# EasyEDA schematic 1-Schematic_SumoBot.json
TITLE: SumobotLeonel; REV: 1.0; Date: 2023-10-10; Sheet: 1/1; Drawn By: stevenleonel22201; Company: NONE
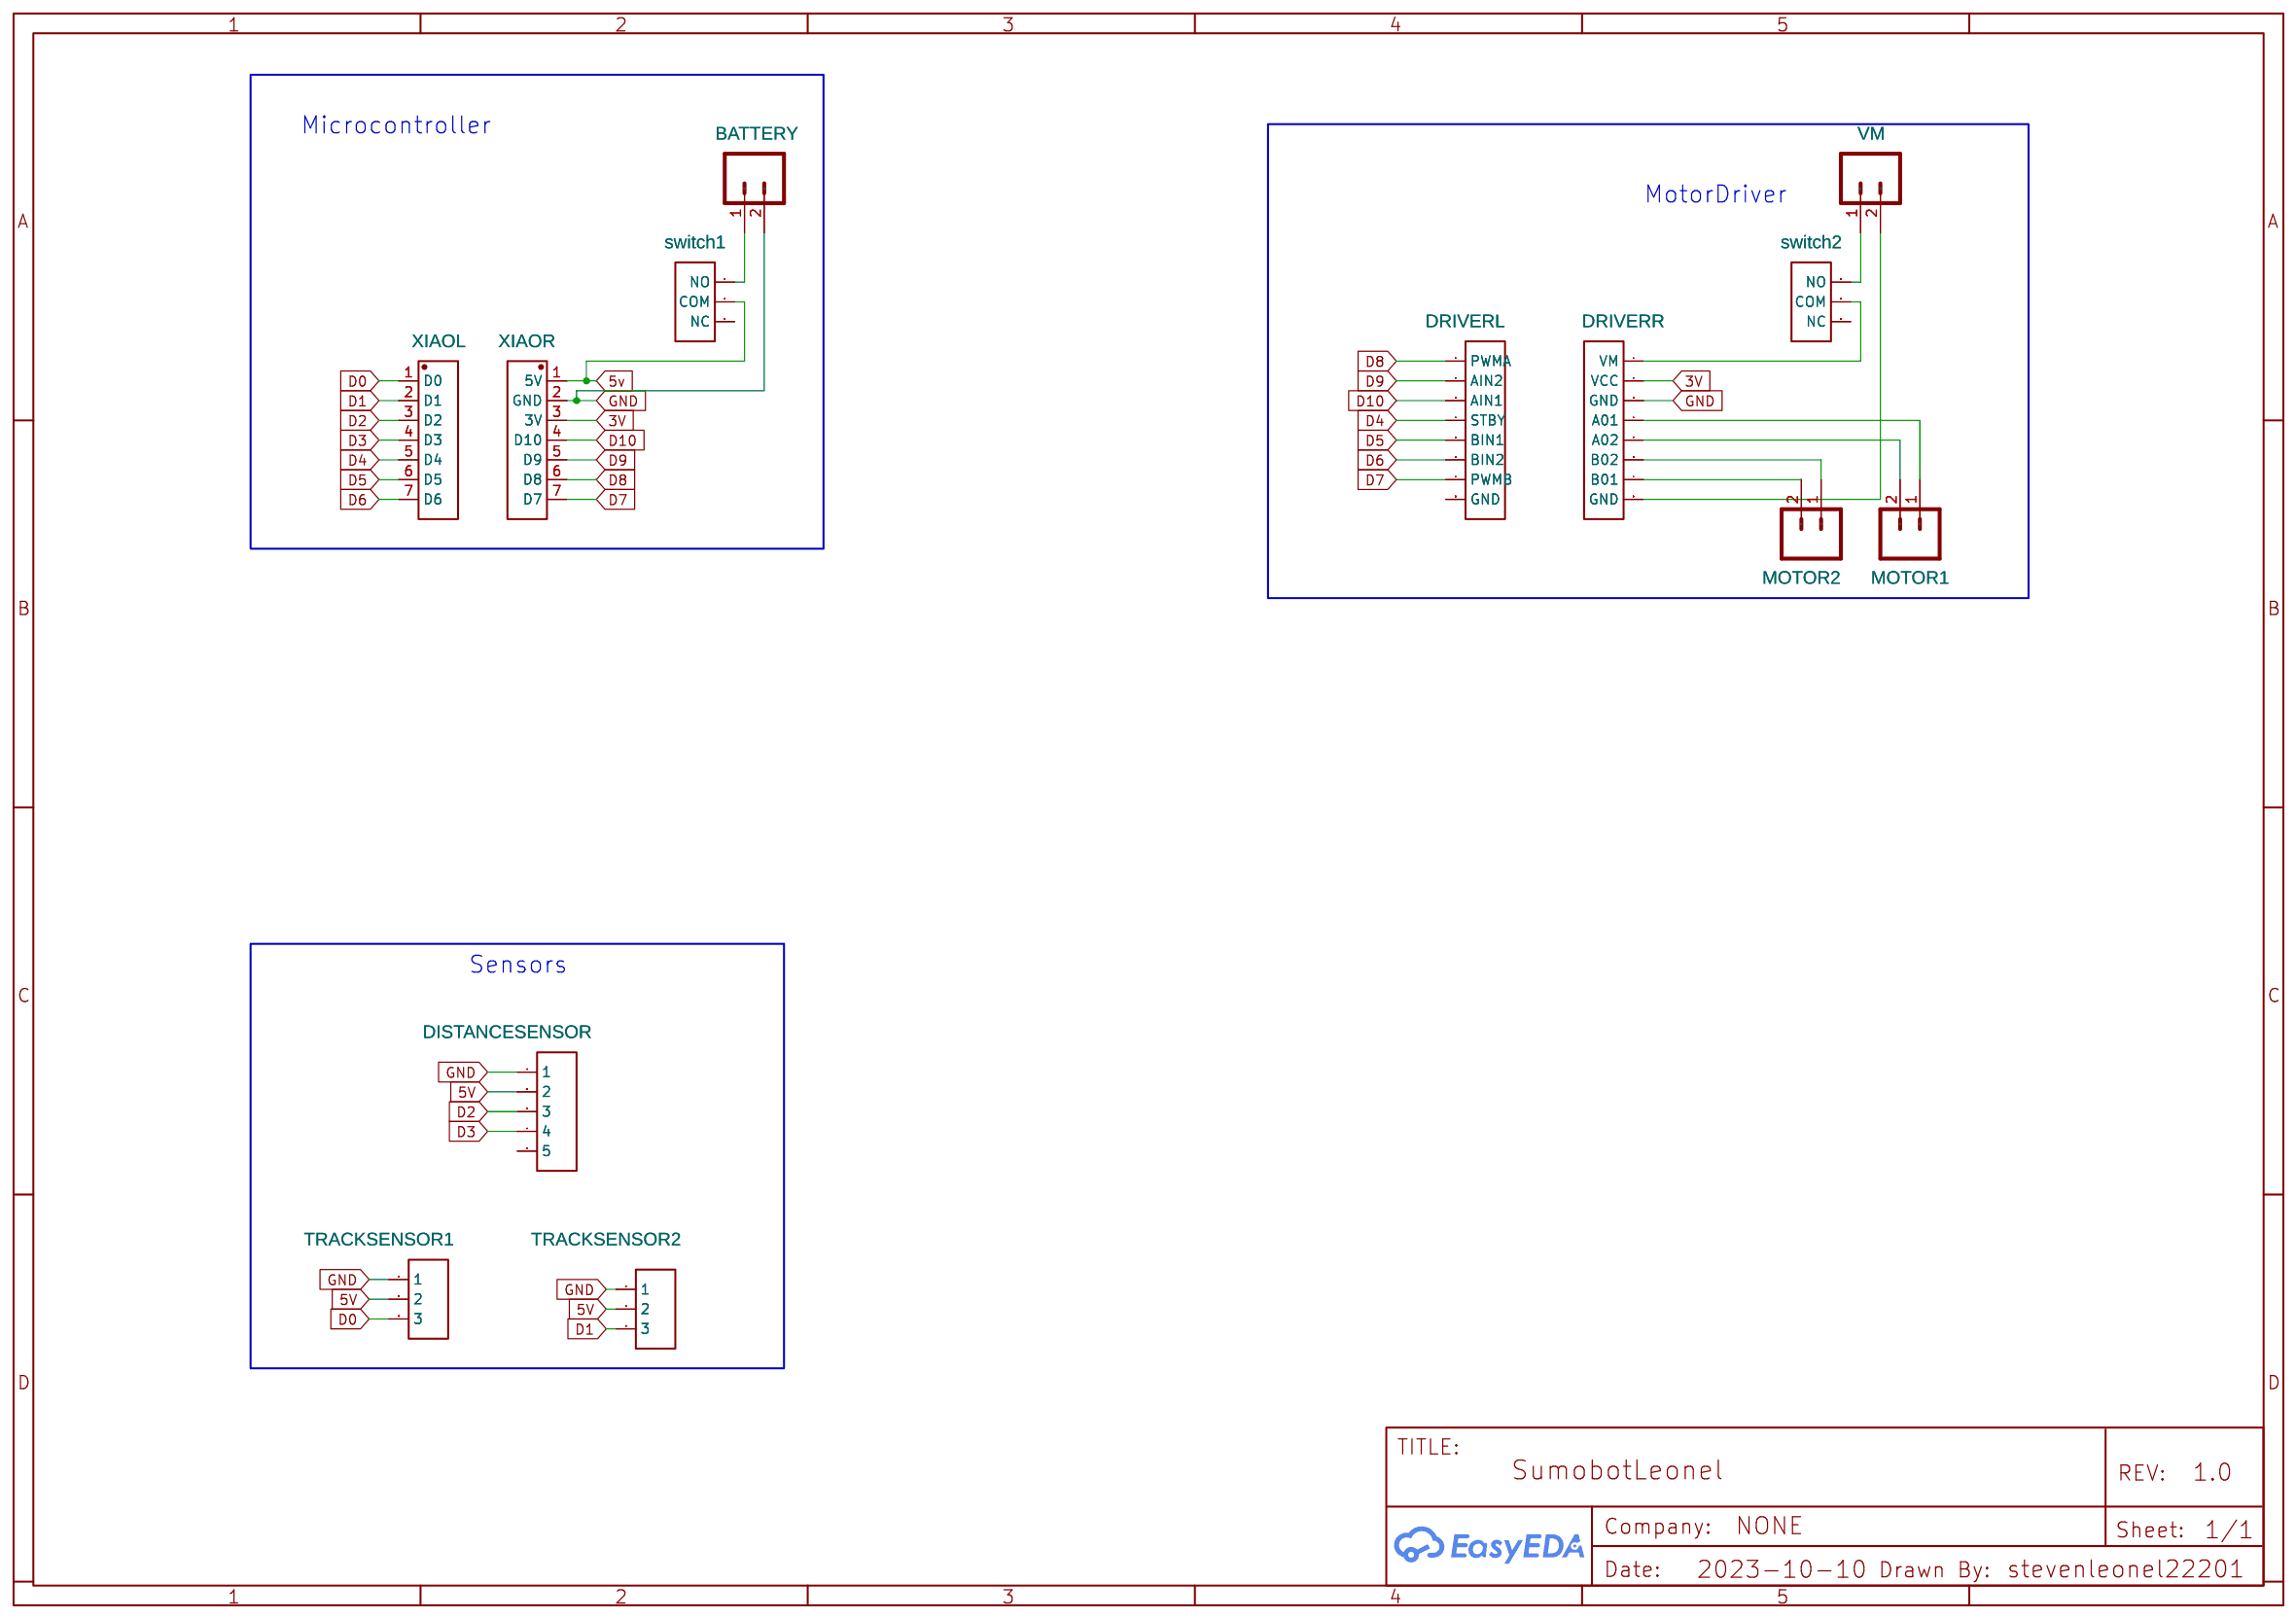
[diagram p0: schematic sheet]

## Parts
BATTERY  NO  [SCREWTERMINAL-5MM-2]
DISTANCESENSOR  Header-Female-2.54_1x5  [HDR-TH_5P-P2.54-V-F]
DRIVERL  TB6612FNG left  [HDR-TH_8P-P2.54-V-F-1]
DRIVERR  TB6612FNG rigth  [HDR-TH_8P-P2.54-V-F-1]
MOTOR1  NO  [SCREWTERMINAL-5MM-2]
MOTOR2  NO  [SCREWTERMINAL-5MM-2]
P1  TRACKSENSOR1  [HDR-TH_3P-P2.54-V-F]
P2  TRACKSENSOR2  [HDR-TH_3P-P2.54-V-F]
P3  switch1  [HDR-TH_3P-P2.54-V-F]
P4  switch2  [HDR-TH_3P-P2.54-V-F]
VM  NO  [SCREWTERMINAL-5MM-2]
XIAOL  PIN HEADER - 1X7  [HEADER - HEADER-FEMALE-2.54_1X7]
XIAOR  PIN HEADER - 1X7  [HEADER - HEADER-FEMALE-2.54_1X7]

## Library data of the parts
BATTERY MOTOR1 MOTOR2 VM = M025MM: Standard 2-pin 0.1 header. Use with; Contributor: SparkFun
DISTANCESENSOR = Header-Female-2.54_1x5: Supplier: LCSC; Manufacturer: BOOMELE(博穆精密); Manufacturer Part: 2.54-1*5P母; Supplier Part: C50950; JLCPCB Part Class: Extended Part; link: https://lcsc.com/eda_search?q=C50950&%26type=1&ref=editor
DRIVERL DRIVERR = Header-Female-2.54_1x8: Supplier: LCSC; Manufacturer: BOOMELE(博穆精密); Manufacturer Part: 2.54-1*8P母环保; Supplier Part: C27438; JLCPCB Part Class: Extended Part; link: https://lcsc.com/eda_search?q=C27438&%26type=1&ref=editor
P1-P4 = Header-Female-2.54_1x3: Supplier Part: C146243; Supplier: LCSC; Manufacturer: BOOMELE(博穆精密); Manufacturer Part: 2.54-1*3P母; JLCPCB Part Class: Extended Part; link: https://lcsc.com/eda_search?q=C146243&%26type=1&ref=editor
XIAOL XIAOR = PIN HEADER - 1X7: Contributor: Harald Bregu

## Nets
3V: DRIVERR.2(VCC) XIAOR.3(3V)
5V: DISTANCESENSOR.2 P1.2 P2.2
5v: P3.2(COM) XIAOR.1(5V)
GND: BATTERY.2 DISTANCESENSOR.1 DRIVERR.3(GND) P1.1 P2.1 XIAOR.2(GND)
D0: P1.3 XIAOL.1(D0)
D1: P2.3 XIAOL.2(D1)
D2: DISTANCESENSOR.3 XIAOL.3(D2)
D3: DISTANCESENSOR.4 XIAOL.4(D3)
D4: DRIVERL.4(STBY) XIAOL.5(D4)
D5: DRIVERL.5(BIN1) XIAOL.6(D5)
D6: DRIVERL.6(BIN2) XIAOL.7(D6)
D7: DRIVERL.7(PWMB) XIAOR.7(D7)
D8: DRIVERL.1(PWMA) XIAOR.6(D8)
D9: DRIVERL.2(AIN2) XIAOR.5(D9)
D10: DRIVERL.3(AIN1) XIAOR.4(D10)
Net-(BATTERY-1): BATTERY.1 P3.1(NO)
Net-(DRIVERR-1): DRIVERR.1(VM) P4.2(COM)
Net-(DRIVERR-4): DRIVERR.4(A01) MOTOR1.1
Net-(DRIVERR-5): DRIVERR.5(A02) MOTOR1.2
Net-(DRIVERR-6): DRIVERR.6(B02) MOTOR2.1
Net-(DRIVERR-7): DRIVERR.7(B01) MOTOR2.2
Net-(DRIVERR-8): DRIVERR.8(GND) VM.2
Net-(P4-1): P4.1(NO) VM.1

Not connected (* = marked no-connect by the designer): DISTANCESENSOR 5; DRIVERL 8(GND); P3 3(NC); P4 3(NC)

## Notes on the sheet
- Microcontroller
- MotorDriver
- Sensors
